# EAGLE schematic Kinect_Rpi_Preg (EAGLE 9.3.0)
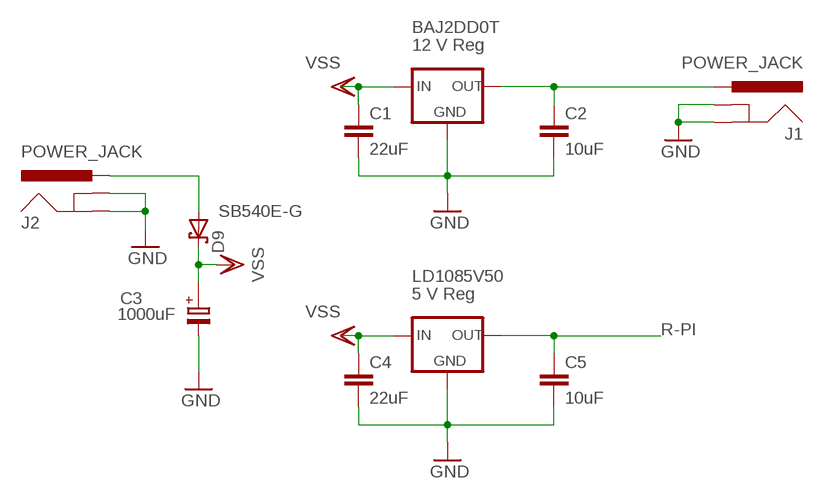
[diagram p0: schematic, sheet 1]

## Parts
BAJ2DD0T  12 V Reg  78MXXL  [78MXXL]
C1  22uF  C-EUC1206  [C1206]
C2  10uF  C-EUC1206  [C1206]
C3  1000uF  C-PR-5,0X10  [E5,0-10]
C4  22uF  C-EUC1206  [C1206]
C5  10uF  C-EUC1206  [C1206]
D9  SB540E-G  SCHOTTKY-DIODEDO-201AD_UPRIGHT  [DO-201AD_UPRIGHT]
J1  POWER_JACK  [POWER_JACK_PTH]
J2  POWER_JACK  [POWER_JACK_PTH]
LD1085V50  5 V Reg  78MXXL  [78MXXL]

## Nets
GND: BAJ2DD0T.GND C1.2 C2.2 C3.- C4.2 C5.2 J1.GND J1.GNDBREAK J2.GND J2.GNDBREAK LD1085V50.GND
N$1: BAJ2DD0T.OUT C2.1 J1.PWR
N$2: D9.1(A) J2.PWR
R-PI: C5.1 LD1085V50.OUT
VSS: BAJ2DD0T.IN C1.1 C3.+ C4.1 D9.2(C) LD1085V50.IN

## Library data of the parts
BAJ2DD0T LD1085V50 = v-reg:78MXXL: VOLTAGE REGULATOR
C1 C2 C4 C5 = rcl:C-EU: CAPACITOR, European symbol; SPICEPREFIX: C
C3 = cap-pan40:C-PR: POLARIZED ELECTROLYTIC/TANTALUM
D9 = diode:SCHOTTKY-DIODE: Schottky Diode
J1 J2 = SparkFun-Connectors:POWER_JACK: Power Jack Connector This is the standard 5.5mm barrel jack for power. The PTH is the most common, proven, reliable, footprint. The Slot footprint only works if the mill layer is transmitted to the PCB fab house so be warned. Here are the connectors we sell at SparkFun: DC Barrel Power Jack/Connector <https://www.sparkfun.com/products/119> (PRT-00119) DC Barrel Power Jack/Connector (SMD) <https://www.sparkfun.com/products/12748> (PRT-12748) DC Barrel Jack Adapter - Breadboard Compatible <https://www.sparkfun.com/products/10811> (PRT-10811) It is used on this SparkFun product (and many, many others): SparkFun RedBoard - Programmed with Arduino <https://www.sparkfun.com/products/12757> (DEV-12757) Also, if you need a mating power supply or connector, please check these out: Wall Adapter Power Supply - 9VDC 650mA <https://www.sparkfun.com/products/298> (TOL-00298) DC Barrel Jack Adapter - Male <https://www.sparkfun.com/products/10287> (PRT-10287); PROD_ID: CONN-08197